# EAGLE design untitled (EAGLE 9.2.0)
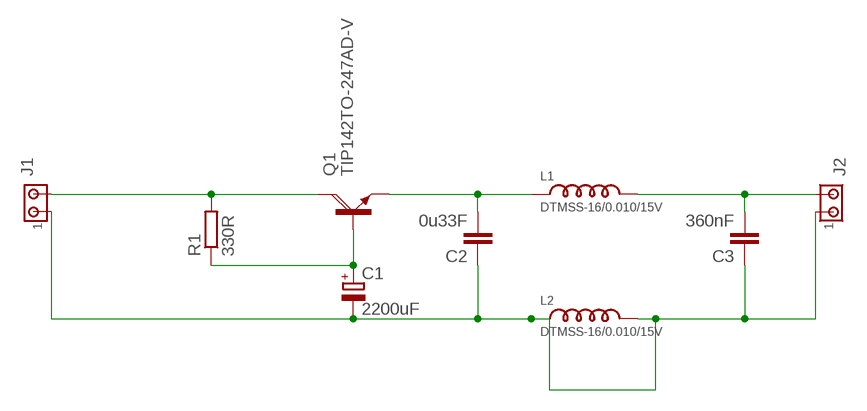
[diagram p0: schematic, sheet 1]

## Parts
C1  2200uF  CPOL-EUE5-13  [E5-13]
C2  0u33F  C-EU102-054X133  [C102-054X133]
C3  360nF  C-EU102-054X133  [C102-054X133]
J1  MTA02-100  [10X02MTA]
J2  MTA02-100  [10X02MTA]
L1  DTMSS-16/0.010/15V  [DTMSS-16/0.010/15-V]
L2  DTMSS-16/0.010/15V  [DTMSS-16/0.010/15-V]
Q1  TIP142TO-247AD-V  [TO-247AD-V]
R1  330R  R-EU_VTA52  [VTA52]

## Nets
GND: C1.- C2.1 C3.1 J1.1 J2.1 L2.P$1 L2.P$2
N$1: J1.2 Q1.D(C) R1.2
N$2: C1.+ Q1.G(B) R1.1
N$3: C2.2 L1.P$1 Q1.S(E)
N$4: C3.2 J2.2 L1.P$2

## Library data of the parts
C1 = rcl:CPOL-EU: POLARIZED CAPACITOR, European symbol
C2 C3 = rcl:C-EU: CAPACITOR, European symbol
J1 J2 = con-amp:MTA02-100: AMP connector
L1 L2 = ferrit_bear:DTMSS-16/0.010/15
Q1 = transistor-power:TIP142: NPN DARLINGTON TRANSISTOR
R1 = resistor:R-EU_: RESISTOR, European symbol

## Board
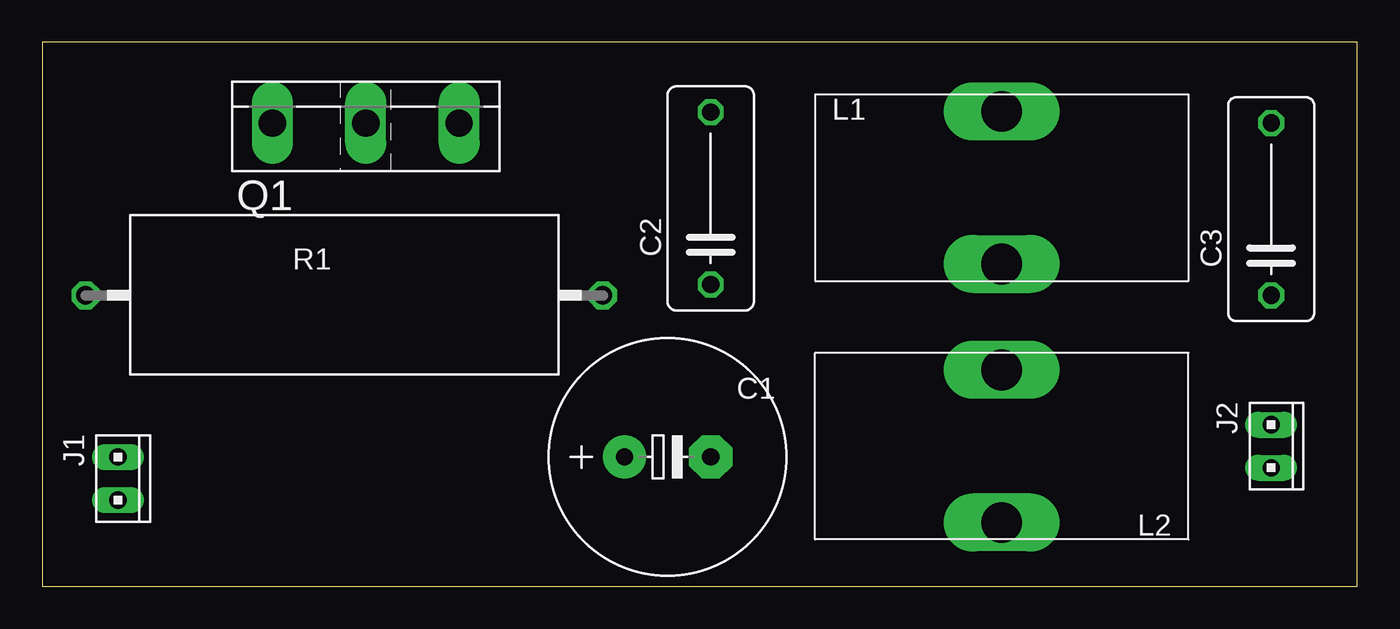
[diagram p1: board, top side]
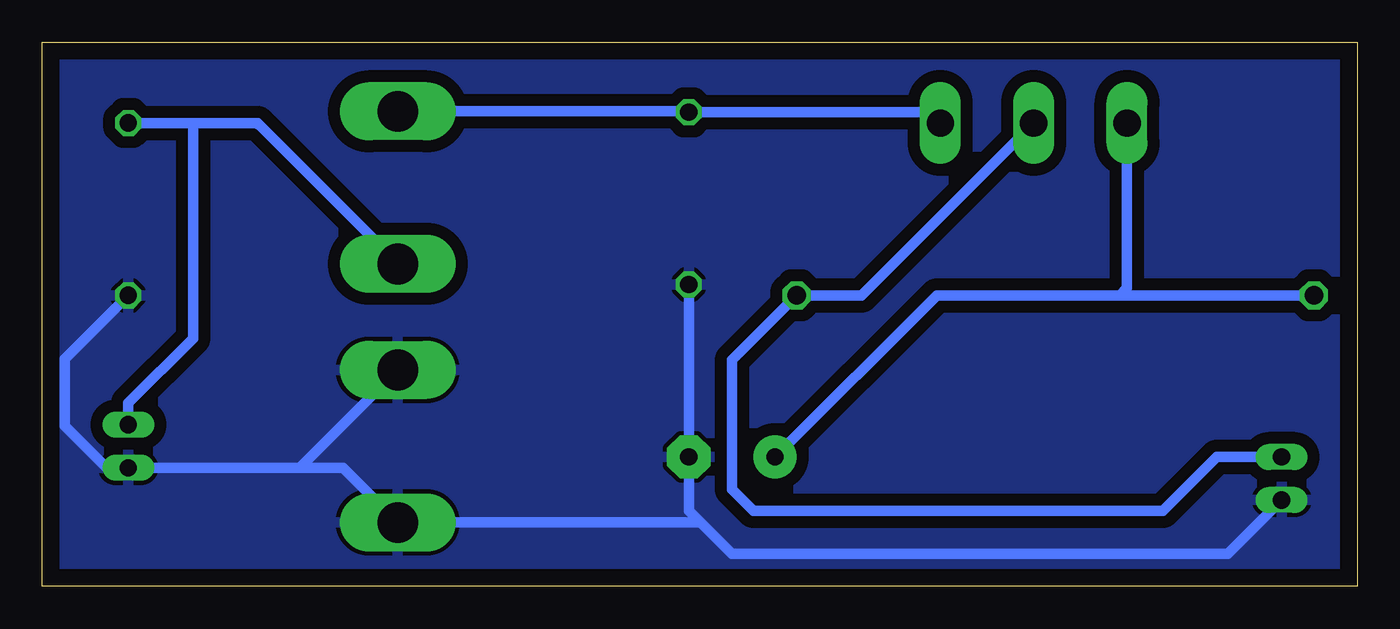
[diagram p2: board, bottom side, seen from below]

Size 77.45 x 32.05 mm. Coordinates in mm from the lower left corner, seen from the top.
Outline: 0,0 77.45,0 77.45,32.05 0,32.05 0,0
Copper layers (1*16): Top 0.035mm / dielectric 1.5mm / Bottom 0.035mm
Design rules "default": minimum track width 10mil, minimum drill 24mil, track to track 8mil, track to pad 8mil, pad to pad 8mil, via to via 8mil, smd to smd 8mil, copper to edge 40mil, drill to drill 8mil, minimum pad ring 10mil, minimum via ring 8mil, stop-mask expansion 4mil, vias tented up to drill 0mil, thermal gap 10mil

### Footprints (pad centres in the part's own frame; a part is rotated, then mirrored left to right if it is on the bottom)
E5-13 = drill 1.016 pad 2.54: + -2.54,0 | drill 1.016 pad 2.54 octagon: - 2.54,0
C102-054X133 = drill 1.016 octagon: 1 -5.08,0; 2 5.08,0
10X02MTA = drill 1.016 long: 1 1.27,0; 2 -1.27,0
DTMSS-16/0.010/15-V = drill 2.4 long: P$1 0,4.5; P$2 0,-4.5
TO-247AD-V = drill 1.6 long: D 0,-2.54; G -5.5,-2.54; S 5.5,-2.54
VTA52 = drill 1.1 octagon: 1 -15.24,0; 2 15.24,0

### Placement (x,y rotation side)
C1  36.83,7.62 0 top
C2  39.37,22.86 90 top
C3  72.39,22.22 90 top
J1  4.45,6.35 270 top
J2  72.39,8.25 270 top
L1  56.51,23.49 0 top
L2  56.51,8.25 180 top
Q1  19.05,29.84 0 top
R1  17.78,17.14 0 top

### Tracks (layer width: path | path; a pad name or v marks a point on that pad's centre or on a via)
GND
  Bottom 0.61: C2.1 C1.- 39.37,4.45 38.68,3.75 | J1.1 7.62,1.9 36.83,1.9 38.68,3.75 | 38.68,3.75 L2.P$1 59.74,6.98 62.29,6.98 | L2.P$2 62.29,6.98 | 62.29,6.98 J2.1 73.66,6.98 76.13,9.45 76.13,13.41 C3.1
  pour Bottom (isolate 0.711): -1.27,33.65 78.74,33.65 78.74,-1.91 -1.27,-1.91
N$1
  Bottom 0.61: Q1.D 29.21,17.14 R1.2 36.83,13.34 36.83,5.71 35.56,4.45 11.43,4.45 8.26,7.62 J1.2
N$2
  Bottom 0.61: R1.1 13.97,17.14 | 13.97,17.14 24.77,17.14 C1.+ | Q1.G 13.55,17.56 13.97,17.14
N$3
  Bottom 0.61: 56.46,27.94 L1.P$1 39.43,27.99 C2.2 25.19,27.94 Q1.S
N$4
  Bottom 0.61: 64.77,27.25 64.77,27.3 | 64.77,27.3 68.58,27.3 | 68.58,27.3 C3.2 | J2.2 72.39,10.79 68.58,14.6 68.58,27.3 | 64.77,27.3 55.88,18.41 55.93,18.41 L1.P$2